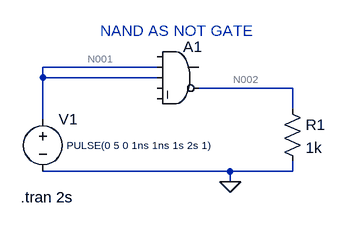
[diagram p0: schematic 201.asc]
201.asc, the LTspice schematic file:
Version 4
SHEET 1 880 680
WIRE -16 48 -192 48
WIRE -192 64 -192 48
WIRE -16 64 -192 64
WIRE 192 80 48 80
WIRE 192 112 192 80
WIRE -192 128 -192 64
WIRE 96 208 -192 208
WIRE 192 208 192 192
WIRE 192 208 96 208
WIRE 96 224 96 208
FLAG 96 224 0
SYMBOL res 176 96 R0
SYMATTR InstName R1
SYMATTR Value 1k
SYMBOL Digital\\and 16 0 R0
SYMATTR InstName A1
SYMBOL voltage -192 112 R0
WINDOW 3 37 56 Left 1
WINDOW 123 0 0 Left 0
WINDOW 39 0 0 Left 0
SYMATTR InstName V1
SYMATTR Value PULSE(0 5 0 1ns 1ns 1s 2s 1)
TEXT -104 -8 Left 2 ;NAND AS NOT GATE
TEXT -226 248 Left 2 !.tran 2s

The netlist it stands for:
* 201.asc
R1 N002 0 1k
A1 0 N001 N001 0 0 N002 0 0 AND
V1 N001 0 PULSE(0 5 0 1ns 1ns 1s 2s 1)
* NAND AS NOT GATE
.tran 2s
.backanno
.end

* Results of the author's LTspice run, read from the files saved beside the schematic
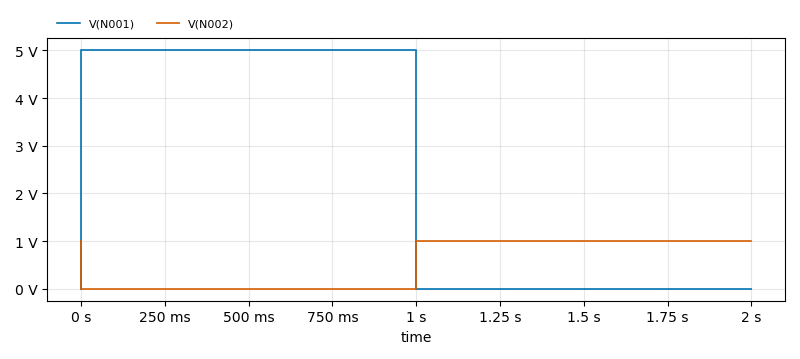
[diagram p1: Transient Analysis of 201.asc, plotted from the saved traces]
* Transient Analysis, 1 run:
*   V(N001): min 0 V, max 5 V, average 2.5 V, rms 3.536 V, last 0 V
*   V(N002): min 0 V, max 999 mV, average 499.5 mV, rms 706.4 mV, last 999 mV